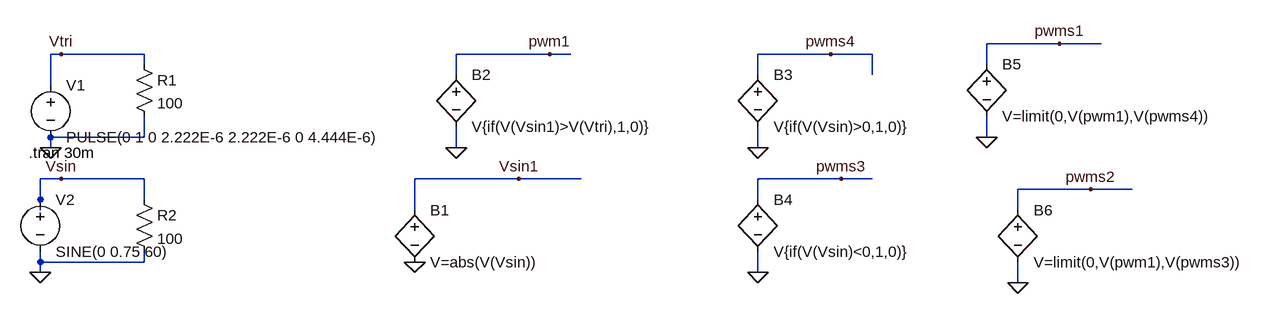
[diagram p0: schematic problem2.asc]
problem2.asc, the LTspice schematic file:
Version 4
SHEET 1 1572 680
WIRE 1248 48 1136 48
WIRE 1312 48 1248 48
WIRE -288 64 -304 64
WIRE -160 64 -288 64
WIRE 464 64 320 64
WIRE 496 64 464 64
WIRE 896 64 784 64
WIRE 960 64 896 64
WIRE -160 80 -160 64
WIRE 1136 80 1136 48
WIRE 320 96 320 64
WIRE 784 96 784 64
WIRE 960 96 960 64
WIRE -304 112 -304 64
WIRE -160 192 -160 160
WIRE -160 192 -304 192
WIRE 1136 192 1136 160
WIRE -304 208 -304 192
WIRE 320 208 320 176
WIRE 784 208 784 176
WIRE -288 256 -320 256
WIRE -160 256 -288 256
WIRE 416 256 256 256
WIRE 512 256 416 256
WIRE 912 256 784 256
WIRE 960 256 912 256
WIRE 1296 272 1184 272
WIRE 1360 272 1296 272
WIRE -320 288 -320 256
WIRE -160 288 -160 256
WIRE 784 288 784 256
WIRE -320 304 -320 288
WIRE 256 304 256 256
WIRE 1184 304 1184 272
WIRE -320 384 -320 368
WIRE -160 384 -160 368
WIRE -160 384 -320 384
WIRE -320 400 -320 384
WIRE 784 400 784 368
WIRE 1184 416 1184 384
FLAG -304 208 0
FLAG -320 400 0
FLAG 320 208 0
FLAG 256 384 0
FLAG -288 64 Vtri
FLAG -288 256 Vsin
FLAG 416 256 Vsin1
FLAG 784 208 0
FLAG 784 400 0
FLAG 464 64 pwm1
FLAG 896 64 pwms4
FLAG 912 256 pwms3
FLAG 1136 192 0
FLAG 1248 48 pwms1
FLAG 1184 416 0
FLAG 1296 272 pwms2
SYMBOL voltage -304 96 R0
WINDOW 123 0 0 Left 0
WINDOW 39 0 0 Left 0
SYMATTR InstName V1
SYMATTR Value PULSE(0 1 0 2.222E-6 2.222E-6 0 4.444E-6)
SYMBOL voltage -320 272 R0
WINDOW 123 0 0 Left 0
WINDOW 39 0 0 Left 0
SYMATTR InstName V2
SYMATTR Value SINE(0 0.75 60)
SYMBOL res -176 64 R0
SYMATTR InstName R1
SYMATTR Value 100
SYMBOL res -176 272 R0
SYMATTR InstName R2
SYMATTR Value 100
SYMBOL bv 256 288 R0
SYMATTR InstName B1
SYMATTR Value V=abs(V(Vsin))
SYMBOL bv 320 80 R0
SYMATTR InstName B2
SYMATTR Value V{if(V(Vsin1)>V(Vtri),1,0)}
SYMBOL bv 784 80 R0
SYMATTR InstName B3
SYMATTR Value V{if(V(Vsin)>0,1,0)}
SYMBOL bv 784 272 R0
SYMATTR InstName B4
SYMATTR Value V{if(V(Vsin)<0,1,0)}
SYMBOL bv 1136 64 R0
SYMATTR InstName B5
SYMATTR Value V=limit(0,V(pwm1),V(pwms4))
SYMBOL bv 1184 288 R0
SYMATTR InstName B6
SYMATTR Value V=limit(0,V(pwm1),V(pwms3))
TEXT -338 216 Left 2 !.tran 30m

The netlist it stands for:
* problem2.asc
V1 Vtri 0 PULSE(0 1 0 2.222E-6 2.222E-6 0 4.444E-6)
V2 Vsin 0 SINE(0 0.75 60)
R1 Vtri 0 100
R2 Vsin 0 100
B1 Vsin1 0 V=abs(V(Vsin))
B2 pwm1 0 V{if(V(Vsin1)>V(Vtri),1,0)}
B3 pwms4 0 V{if(V(Vsin)>0,1,0)}
B4 pwms3 0 V{if(V(Vsin)<0,1,0)}
B5 pwms1 0 V=limit(0,V(pwm1),V(pwms4))
B6 pwms2 0 V=limit(0,V(pwm1),V(pwms3))
.tran 30m
.backanno
.end